# Altium schematic sheet SCH.SchDoc
size A1
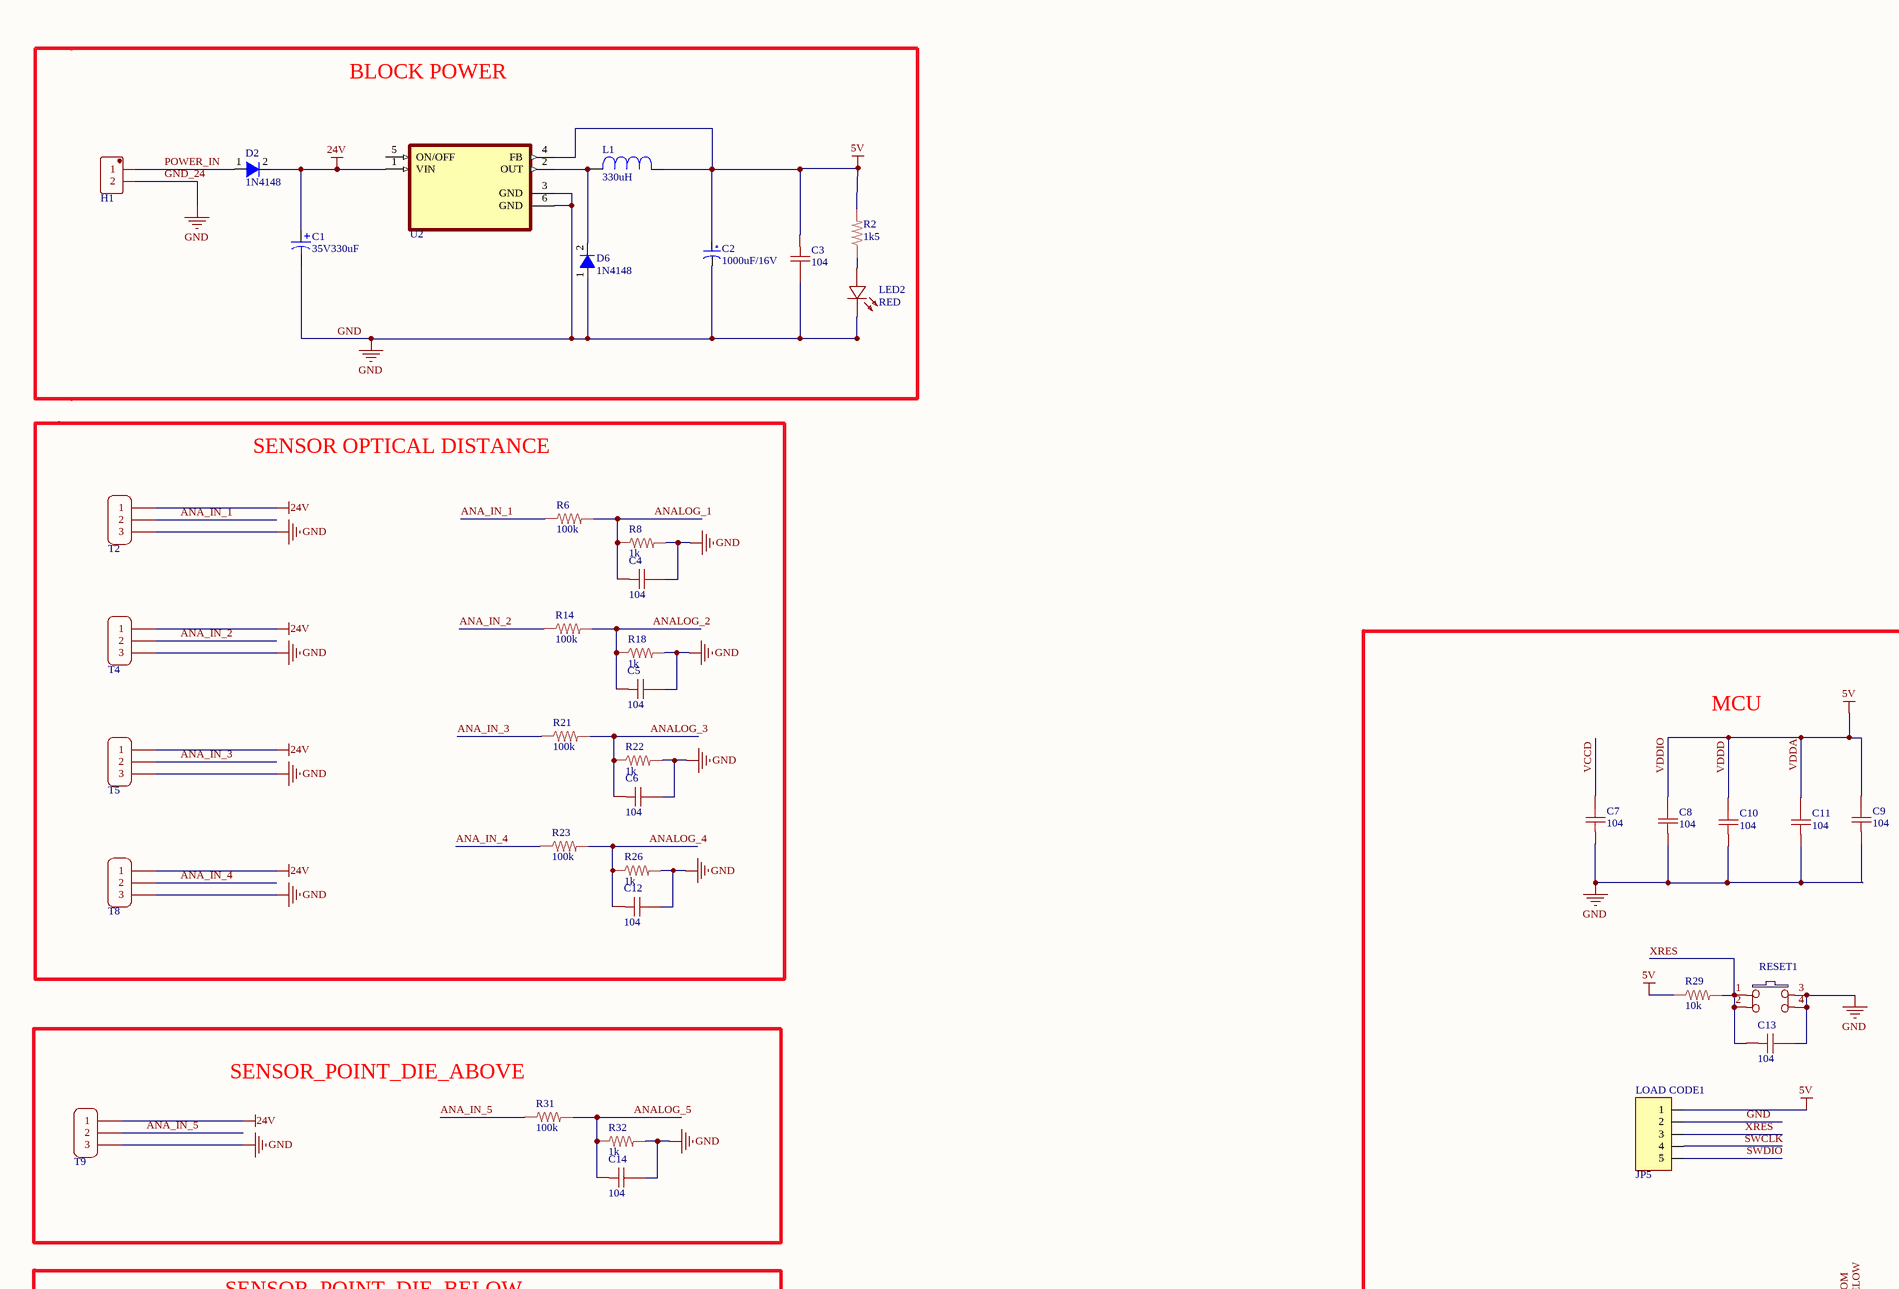
[diagram p0: SCH.SchDoc, top left]
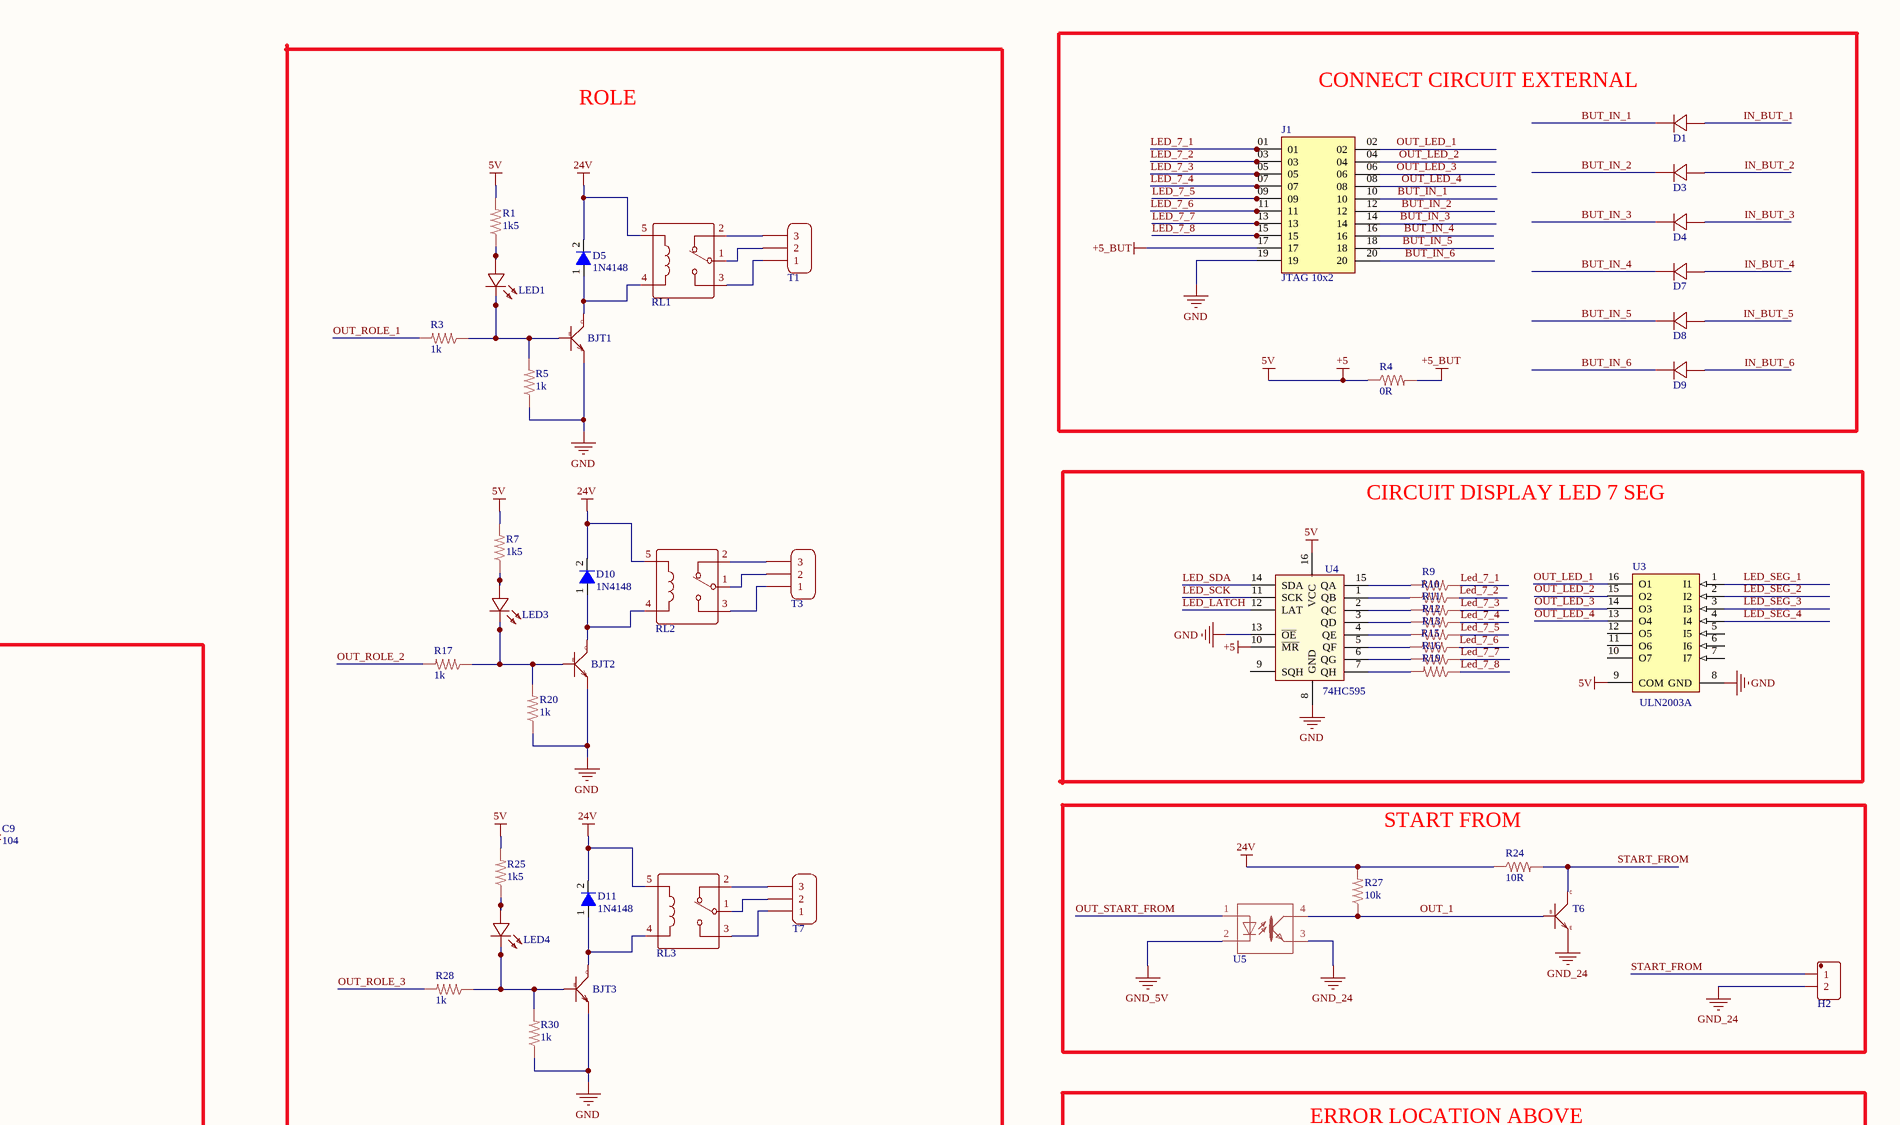
[diagram p1: SCH.SchDoc, top right]
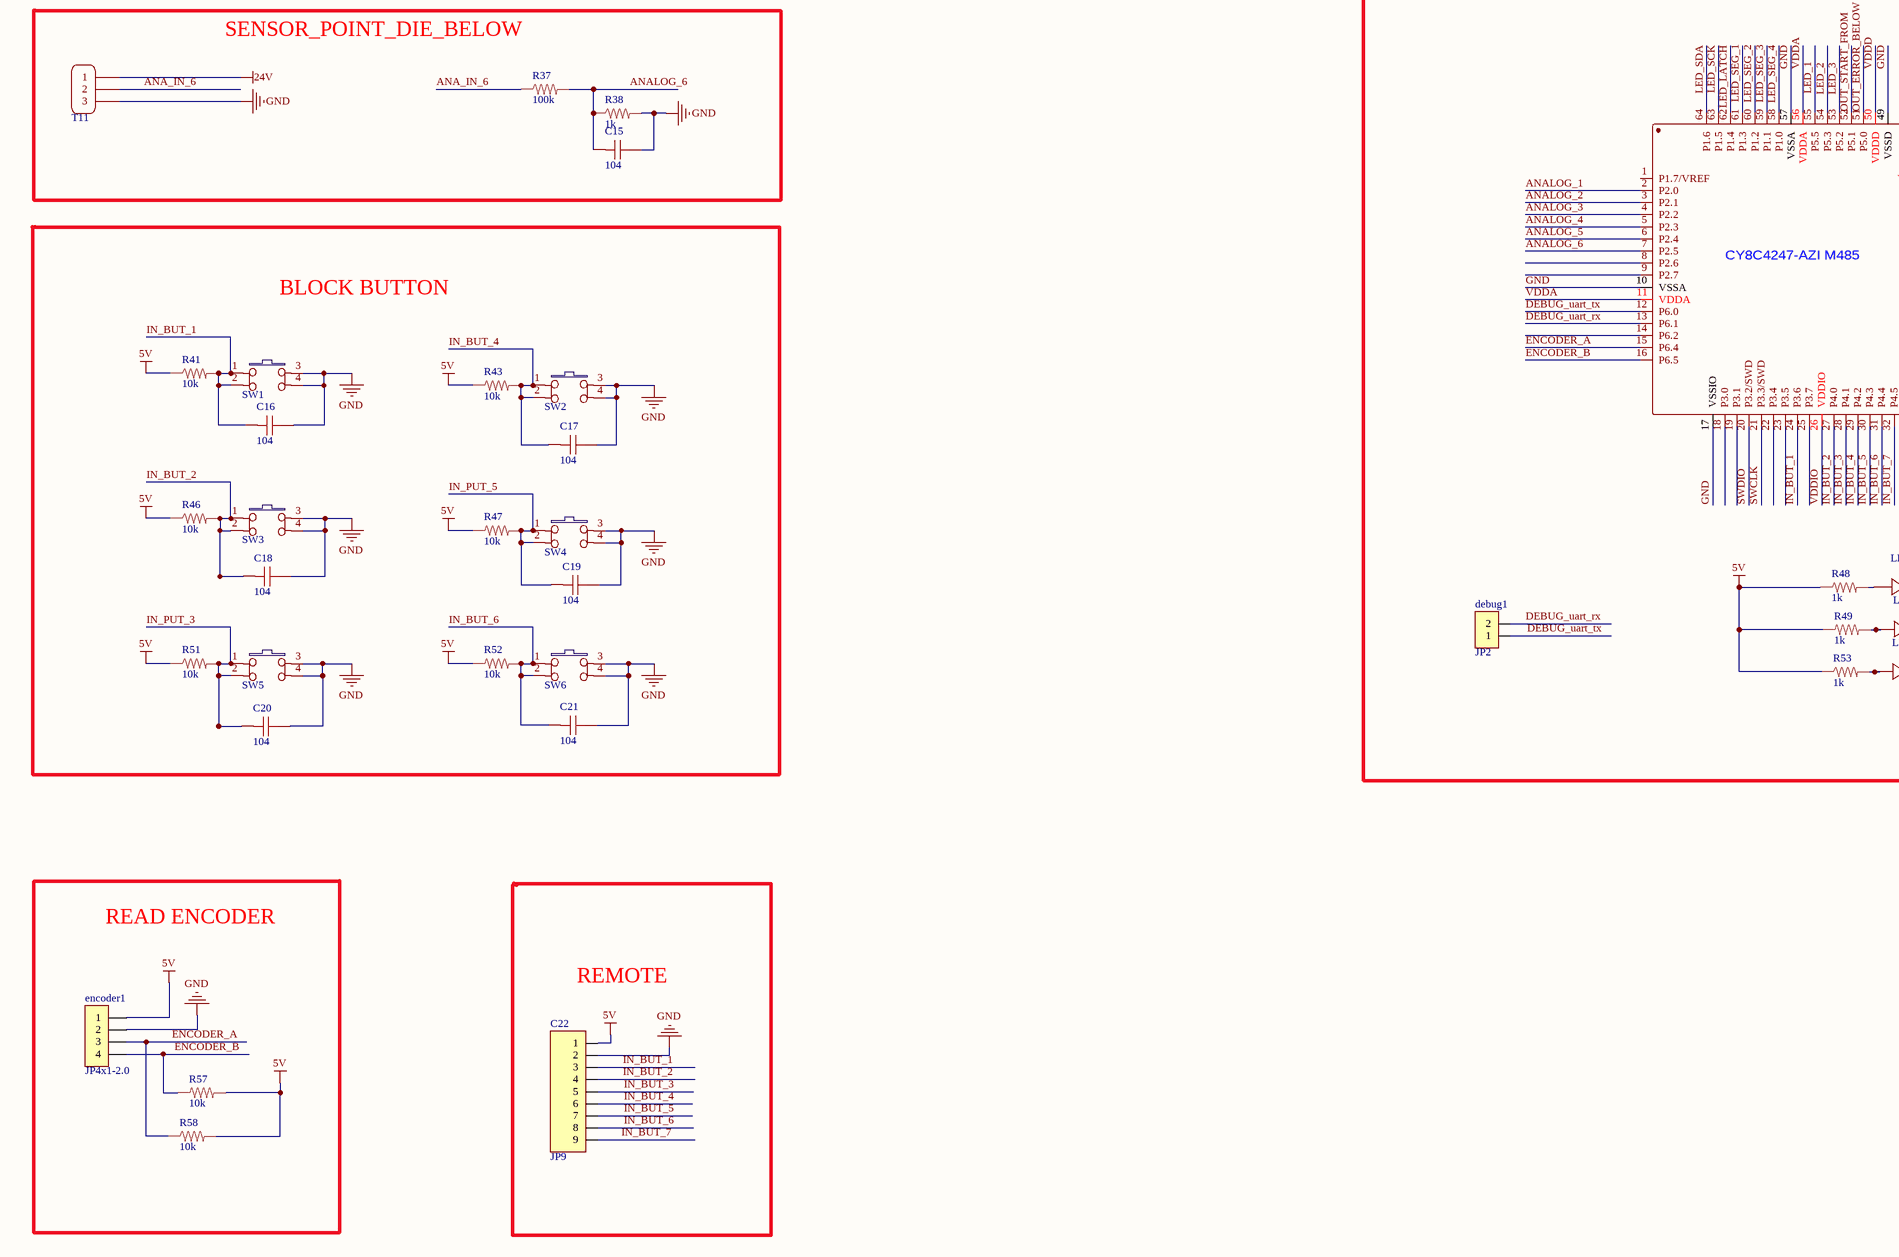
[diagram p2: SCH.SchDoc, bottom left]
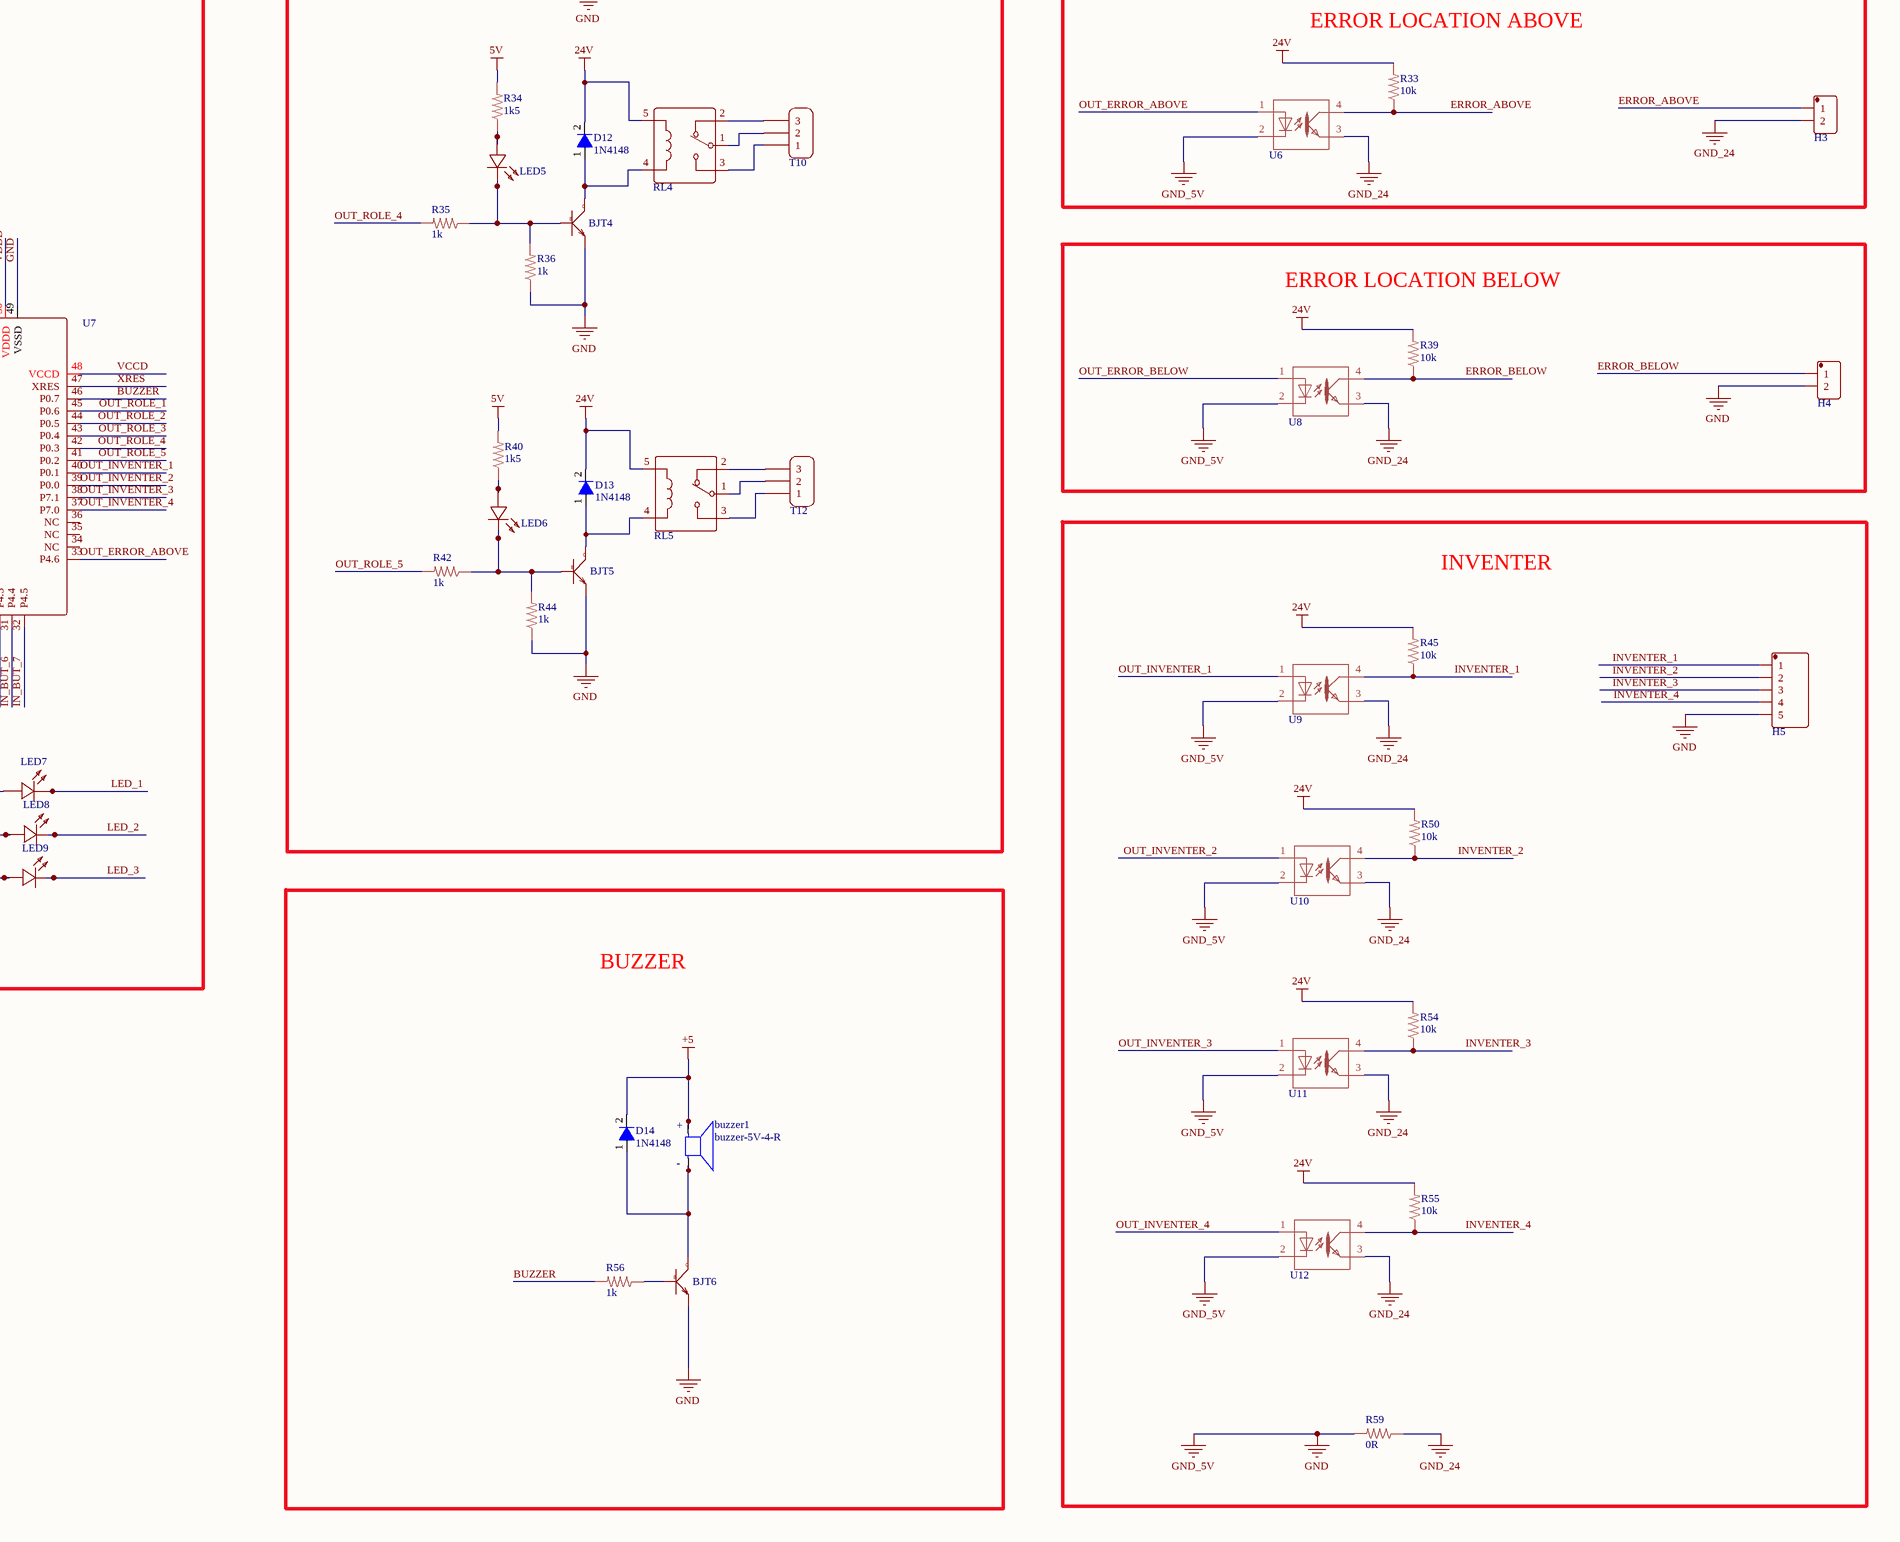
[diagram p3: SCH.SchDoc, bottom right]

## Parts
BJT1  NPN-SOT23  [SOT-23]  (value not drawn)
BJT2  NPN-SOT23  [SOT-23]  (value not drawn)
BJT3  NPN-SOT23  [SOT-23]  (value not drawn)
BJT4  NPN-SOT23  [SOT-23]  (value not drawn)
BJT5  NPN-SOT23  [SOT-23]  (value not drawn)
BJT6  NPN-SOT23  [SOT-23]  (value not drawn)
buzzer1  buzzer-5V-4-R  [buzzer 5V]
C1  35V330uF  [CAP POLY 220UF 16V]
C2  1000uF/16V  [CAP-ALU-SMD-F]
C3  value 104  [CAP_SMD_1206]  (hidden comment: Cap_SMD)
C4  value 104  [CAP_SMD_1206]  (hidden comment: Cap_SMD)
C5  value 104  [CAP_SMD_1206]  (hidden comment: Cap_SMD)
C6  value 104  [CAP_SMD_1206]  (hidden comment: Cap_SMD)
C7  value 104  [CAP_SMD_1206]  (hidden comment: Cap_SMD)
C8  value 104  [CAP_SMD_1206]  (hidden comment: Cap_SMD)
C9  value 104  [CAP_SMD_1206]  (hidden comment: Cap_SMD)
C10  value 104  [CAP_SMD_1206]  (hidden comment: Cap_SMD)
C11  value 104  [CAP_SMD_1206]  (hidden comment: Cap_SMD)
C12  value 104  [CAP_SMD_1206]  (hidden comment: Cap_SMD)
C13  value 104  [CAP_SMD_1206]  (hidden comment: Cap_SMD)
C14  value 104  [CAP_SMD_1206]  (hidden comment: Cap_SMD)
C15  value 104  [CAP_SMD_1206]  (hidden comment: Cap_SMD)
C16  value 104  [CAP_SMD_1206]  (hidden comment: Cap_SMD)
C17  value 104  [CAP_SMD_1206]  (hidden comment: Cap_SMD)
C18  value 104  [CAP_SMD_1206]  (hidden comment: Cap_SMD)
C19  value 104  [CAP_SMD_1206]  (hidden comment: Cap_SMD)
C20  value 104  [CAP_SMD_1206]  (hidden comment: Cap_SMD)
C21  value 104  [CAP_SMD_1206]  (hidden comment: Cap_SMD)
C22  JP9  [JP9-D1T]
D1  1N4007  [Diode M7]  (value not drawn)
D2  1N4148  [SOD-123]
D3  1N4007  [Diode M7]  (value not drawn)
D4  1N4007  [Diode M7]  (value not drawn)
D5  1N4148  [SOD-123]
D6  1N4148  [SOD-123]
D7  1N4007  [Diode M7]  (value not drawn)
D8  1N4007  [Diode M7]  (value not drawn)
D9  1N4007  [Diode M7]  (value not drawn)
D10  1N4148  [SOD-123]
D11  1N4148  [SOD-123]
D12  1N4148  [SOD-123]
D13  1N4148  [SOD-123]
D14  1N4148  [SOD-123]
debug1  JP2  [JP2-D1T]
encoder1  JP4x1-2.0  [J4-D1T]
H1  Terminal2x5.08  [EDG2P508]  (value not drawn)
H2  Terminal2x5.08  [EDG2P508]  (value not drawn)
H3  Terminal2x5.08  [EDG2P508]  (value not drawn)
H4  Terminal2x5.08  [EDG2P508]  (value not drawn)
H5  Terminal5x5.08  [EDG5P508]  (value not drawn)
J1  JTAG 10x2  [JTAG]
L1  value 330uH  [Inductor DR127]  (hidden comment: Inductor DR127)
LED1  LED_SMD  [LED_SMD_0805]  (value not drawn)
LED2  value RED  [LED_SMD_0805]  (hidden comment: LED_SMD)
LED3  LED_SMD  [LED_SMD_0805]  (value not drawn)
LED4  LED_SMD  [LED_SMD_0805]  (value not drawn)
LED5  LED_SMD  [LED_SMD_0805]  (value not drawn)
LED6  LED_SMD  [LED_SMD_0805]  (value not drawn)
LED7  LED_SMD  [LED_SMD_0805]  (value not drawn)
LED8  LED_SMD  [LED_SMD_0805]  (value not drawn)
LED9  LED_SMD  [LED_SMD_0805]  (value not drawn)
LOAD_CODE1  JP5  [JP5-D1T]
R1  value 1k5  [Res_SMD_0805]  (hidden comment: Res_SMD)
R2  value 1k5  [Res_SMD_0805]  (hidden comment: Res_SMD)
R3  value 1k  [Res_SMD_0805]  (hidden comment: Res_SMD)
R4  value 0R  [Res_SMD_1206]  (hidden comment: Res_SMD)
R5  value 1k  [Res_SMD_0805]  (hidden comment: Res_SMD)
R6  value 100k  [Res_SMD_1206]  (hidden comment: Res_SMD)
R7  value 1k5  [Res_SMD_0805]  (hidden comment: Res_SMD)
R8  value 1k  [Res_SMD_1206]  (hidden comment: Res_SMD)
R9  Res_SMD  [Res_SMD_0805]  (value not drawn)
R10  Res_SMD  [Res_SMD_0805]  (value not drawn)
R11  Res_SMD  [Res_SMD_0805]  (value not drawn)
R12  Res_SMD  [Res_SMD_0805]  (value not drawn)
R13  Res_SMD  [Res_SMD_0805]  (value not drawn)
R14  value 100k  [Res_SMD_1206]  (hidden comment: Res_SMD)
R15  Res_SMD  [Res_SMD_0805]  (value not drawn)
R16  Res_SMD  [Res_SMD_0805]  (value not drawn)
R17  value 1k  [Res_SMD_0805]  (hidden comment: Res_SMD)
R18  value 1k  [Res_SMD_1206]  (hidden comment: Res_SMD)
R19  Res_SMD  [Res_SMD_0805]  (value not drawn)
R20  value 1k  [Res_SMD_0805]  (hidden comment: Res_SMD)
R21  value 100k  [Res_SMD_1206]  (hidden comment: Res_SMD)
R22  value 1k  [Res_SMD_1206]  (hidden comment: Res_SMD)
R23  value 100k  [Res_SMD_1206]  (hidden comment: Res_SMD)
R24  value 10R  [RES_SMD_2512]  (hidden comment: Res_SMD)
R25  value 1k5  [Res_SMD_0805]  (hidden comment: Res_SMD)
R26  value 1k  [Res_SMD_1206]  (hidden comment: Res_SMD)
R27  value 10k  [Res_SMD_1206]  (hidden comment: Res_SMD)
R28  value 1k  [Res_SMD_0805]  (hidden comment: Res_SMD)
R29  value 10k  [Res_SMD_1206]  (hidden comment: Res_SMD)
R30  value 1k  [Res_SMD_0805]  (hidden comment: Res_SMD)
R31  value 100k  [Res_SMD_1206]  (hidden comment: Res_SMD)
R32  value 1k  [Res_SMD_1206]  (hidden comment: Res_SMD)
R33  value 10k  [Res_SMD_1206]  (hidden comment: Res_SMD)
R34  value 1k5  [Res_SMD_0805]  (hidden comment: Res_SMD)
R35  value 1k  [Res_SMD_0805]  (hidden comment: Res_SMD)
R36  value 1k  [Res_SMD_0805]  (hidden comment: Res_SMD)
R37  value 100k  [Res_SMD_1206]  (hidden comment: Res_SMD)
R38  value 1k  [Res_SMD_1206]  (hidden comment: Res_SMD)
R39  value 10k  [Res_SMD_1206]  (hidden comment: Res_SMD)
R40  value 1k5  [Res_SMD_0805]  (hidden comment: Res_SMD)
R41  value 10k  [Res_SMD_1206]  (hidden comment: Res_SMD)
R42  value 1k  [Res_SMD_0805]  (hidden comment: Res_SMD)
R43  value 10k  [Res_SMD_1206]  (hidden comment: Res_SMD)
R44  value 1k  [Res_SMD_0805]  (hidden comment: Res_SMD)
R45  value 10k  [Res_SMD_1206]  (hidden comment: Res_SMD)
R46  value 10k  [Res_SMD_1206]  (hidden comment: Res_SMD)
R47  value 10k  [Res_SMD_1206]  (hidden comment: Res_SMD)
R48  value 1k  [Res_SMD_1206]  (hidden comment: Res_SMD)
R49  value 1k  [Res_SMD_1206]  (hidden comment: Res_SMD)
R50  value 10k  [Res_SMD_1206]  (hidden comment: Res_SMD)
R51  value 10k  [Res_SMD_1206]  (hidden comment: Res_SMD)
R52  value 10k  [Res_SMD_1206]  (hidden comment: Res_SMD)
R53  value 1k  [Res_SMD_1206]  (hidden comment: Res_SMD)
R54  value 10k  [Res_SMD_1206]  (hidden comment: Res_SMD)
R55  value 10k  [Res_SMD_1206]  (hidden comment: Res_SMD)
R56  value 1k  [Res_SMD_0805]  (hidden comment: Res_SMD)
R57  value 10k  [Res_SMD_1206]  (hidden comment: Res_SMD)
R58  value 10k  [Res_SMD_1206]  (hidden comment: Res_SMD)
R59  value 0R  [Res_SMD_1206]  (hidden comment: Res_SMD)
RESET1  Button6x6  [Button6x6smd]  (value not drawn)
RL1  ReLay12V  [Relay 12V]  (value not drawn)
RL2  ReLay12V  [Relay 12V]  (value not drawn)
RL3  ReLay12V  [Relay 12V]  (value not drawn)
RL4  ReLay12V  [Relay 12V]  (value not drawn)
RL5  ReLay12V  [Relay 12V]  (value not drawn)
SW1  Button6x6  [Button6x6smd]  (value not drawn)
SW2  Button6x6  [Button6x6smd]  (value not drawn)
SW3  Button6x6  [Button6x6smd]  (value not drawn)
SW4  Button6x6  [Button6x6smd]  (value not drawn)
SW5  Button6x6  [Button6x6smd]  (value not drawn)
SW6  Button6x6  [Button6x6smd]  (value not drawn)
T1  Terminal B 3P  [Terminal-3p-381]  (value not drawn)
T2  Terminal B 3P  [Terminal-3p-381]  (value not drawn)
T3  Terminal B 3P  [Terminal-3p-381]  (value not drawn)
T4  Terminal B 3P  [Terminal-3p-381]  (value not drawn)
T5  Terminal B 3P  [Terminal-3p-381]  (value not drawn)
T6  TIP41C  [TO252]  (value not drawn)
T7  Terminal B 3P  [Terminal-3p-381]  (value not drawn)
T8  Terminal B 3P  [Terminal-3p-381]  (value not drawn)
T9  Terminal B 3P  [Terminal-3p-381]  (value not drawn)
T10  Terminal B 3P  [Terminal-3p-381]  (value not drawn)
T11  Terminal B 3P  [Terminal-3p-381]  (value not drawn)
T12  Terminal B 3P  [Terminal-3p-381]  (value not drawn)
U2  LM2576  [LM2576-5.0]  (value not drawn)
U3  ULN2003A  [SO-16]
U4  74HC595  [Sop16pin]
U5  PC817  [PC817]  (value not drawn)
U6  PC817  [PC817]  (value not drawn)
U7  CY8C4247  [TQFP64]  (value not drawn)
U8  PC817  [PC817]  (value not drawn)
U9  PC817  [PC817]  (value not drawn)
U10  PC817  [PC817]  (value not drawn)
U11  PC817  [PC817]  (value not drawn)
U12  PC817  [PC817]  (value not drawn)

## Blocks framed on the sheet
CONNECT CIRCUIT EXTERNAL: D1 D3 D4 D7-D9 J1 R4
BLOCK POWER: C1-C3 D2 D6 H1 L1 LED2 R2 U2
SENSOR OPTICAL DISTANCE: C4-C6 C12 R6 R8 R14 R18 R21-R23 R26 T2 T4 T5 T8
MCU: C7-C11 C13 debug1 LED7-LED9 LOAD_CODE1 R29 R48 R49 R53 RESET1 U7
START FROM: H2 R24 R27 T6 U5
SENSOR_POINT_DIE_ABOVE: C14 R31 R32 T9
ERROR LOCATION ABOVE: H3 R33 U6
SENSOR_POINT_DIE_BELOW: C15 R37 R38 T11
ERROR LOCATION BELOW: H4 R39 U8
BLOCK BUTTON: C16-C21 R41 R43 R46 R47 R51 R52 SW1-SW6
INVENTER: H5 R45 R50 R54 R55 R59 U9-U12
BUZZER: BJT6 buzzer1 D14 R56
READ ENCODER: encoder1 R57 R58

## Nets
24V: C1.1 D2.2(K) D5.2(K) D10.2(K) D11.2(K) D12.2(K) D13.2(K) R24.1 R27.2 R33.2 R39.2 R45.2 R50.2 R54.2 R55.2 RL1.5 RL2.5 RL3.5 RL4.5 RL5.5 T2.1 T4.1 T5.1 T8.1 T9.1 T11.1 U2.1(VIN)
+5_BUT: J1.17 R4.2
GND: BJT1.2 BJT2.2 BJT3.2 BJT4.2 BJT5.2 BJT6.2 C1.2 C2.2 C3.1 C4.1 C5.1 C6.1 C7.2 C8.2 C9.2 C10.2 C11.2 C12.1 C13.1 C14.1 C15.1 C16.1 C17.1 C18.1 C19.1 C20.1 C21.1 C22.2 D6.1(A) encoder1.2 H1.2 H2.2 H3.2 H4.2 H5.5 J1.19 LED2.2(K) LOAD_CODE1.2 R5.1 R8.2 R18.2 R20.1 R22.2 R26.2 R30.1 R32.2 R36.1 R38.2 R44.1 R59.1 R59.2 RESET1.3 RESET1.4 SW1.3 SW1.4 SW2.3 SW2.4 SW3.3 SW3.4 SW4.3 SW4.4 SW5.3 SW5.4 SW6.3 SW6.4 T2.3 T4.3 T5.3 T6.3(C) T8.3 T9.3 T11.3 U2.3(GND) U2.6(GND) U3.8(GND) U4.8(GND) U4.13(~{OE}) U5.2(C) U5.3(EMIT) U6.2(C) U6.3(EMIT) U7.10(VSSA) U7.17(VSSIO) U7.49(VSSD) U7.57(VSSA) U8.2(C) U8.3(EMIT) U9.2(C) U9.3(EMIT) U10.2(C) U10.3(EMIT) U11.2(C) U11.3(EMIT) U12.2(C) U12.3(EMIT)  [also labelled GND_24, GND_5V]
VDDA: buzzer1.P C2.1 C3.2 C8.1 C9.1 C10.1 C11.1 C22.1 D14.2(K) encoder1.1 L1.1 LOAD_CODE1.1 R1.2 R2.2 R4.1 R7.2 R25.2 R29.1 R34.2 R40.2 R41.1 R43.1 R46.1 R47.1 R48.1 R49.1 R51.1 R52.1 R53.1 R57.2 R58.2 U2.4(FB) U3.9(COM) U4.10(~{MR}) U4.16(VCC) U7.11(VDDA) U7.26(VDDIO) U7.50(VDDD) U7.56(VDDA)  [also labelled +5, 5V, VDDD, VDDIO]
ANA_IN_1: R6.1 T2.2
ANA_IN_2: R14.1 T4.2
ANA_IN_3: R21.1 T5.2
ANA_IN_4: R23.1 T8.2
ANA_IN_5: R31.1 T9.2
ANA_IN_6: R37.1 T11.2
ANALOG_1: C4.2 R6.2 R8.1 U7.2(P2.0)
ANALOG_2: C5.2 R14.2 R18.1 U7.3(P2.1)
ANALOG_3: C6.2 R21.2 R22.1 U7.4(P2.2)
ANALOG_4: C12.2 R23.2 R26.1 U7.5(P2.3)
ANALOG_5: C14.2 R31.2 R32.1 U7.6(P2.4)
ANALOG_6: C15.2 R37.2 R38.1 U7.7(P2.5)
BUT_IN_1: D1.2(K) J1.10
BUT_IN_2: D3.2(K) J1.12
BUT_IN_3: D4.2(K) J1.14
BUT_IN_4: D7.2(K) J1.16
BUT_IN_5: D8.2(K) J1.18
BUT_IN_6: D9.2(K) J1.20
BUZZER: R56.2 U7.46(P0.7)
DEBUG_uart_rx: debug1.2 U7.13(P6.1)
DEBUG_uart_tx: debug1.1 U7.12(P6.0)
ENCODER_A: encoder1.3 R58.1 U7.15(P6.4)
ENCODER_B: encoder1.4 R57.1 U7.16(P6.5)
ERROR_ABOVE: H3.1 R33.1 U6.4(COL)
ERROR_BELOW: H4.1 R39.1 U8.4(COL)
IN_BUT_1: C16.2 C22.3 D1.1(A) R41.2 SW1.1 SW1.2 U7.24(P3.6)
IN_BUT_2: C18.2 C22.4 D3.1(A) R46.2 SW3.1 SW3.2 U7.27(P4.0)
IN_BUT_3: C22.5 D4.1(A) U7.28(P4.1)
IN_BUT_4: C17.2 C22.6 D7.1(A) R43.2 SW2.1 SW2.2 U7.29(P4.2)
IN_BUT_5: C22.7 D8.1(A) U7.30(P4.3)
IN_BUT_6: C21.2 C22.8 D9.1(A) R52.2 SW6.1 SW6.2 U7.31(P4.4)
IN_BUT_7: C22.9 U7.32(P4.5)
IN_PUT_3: C20.2 R51.2 SW5.1 SW5.2
IN_PUT_5: C19.2 R47.2 SW4.1 SW4.2
INVENTER_1: H5.1 R45.1 U9.4(COL)
INVENTER_2: H5.2 R50.1 U10.4(COL)
INVENTER_3: H5.3 R54.1 U11.4(COL)
INVENTER_4: H5.4 R55.1 U12.4(COL)
LED_1: LED7.2(K) U7.55(P5.5)
LED_2: LED8.2(K) U7.54(P5.3)
LED_3: LED9.2(K) U7.53(P5.2)
LED_7_1: J1.01 R9.1
LED_7_2: J1.03 R10.1
LED_7_3: J1.05 R11.1
LED_7_4: J1.07 R12.1
LED_7_5: J1.09 R13.1
LED_7_6: J1.11 R15.1
LED_7_7: J1.13 R16.1
LED_7_8: J1.15 R19.1
LED_LATCH: U4.12(LAT) U7.62(P1.4)
LED_SCK: U4.11(SCK) U7.63(P1.5)
LED_SDA: U4.14(SDA) U7.64(P1.6)
LED_SEG_1: U3.1(I1) U7.61(P1.3)
LED_SEG_2: U3.2(I2) U7.60(P1.2)
LED_SEG_3: U3.3(I3) U7.59(P1.1)
LED_SEG_4: U3.4(I4) U7.58(P1.0)
OUT_1: R27.1 T6.1(B) U5.4(COL)
OUT_ERROR_ABOVE: U6.1(A) U7.33(P4.6)
OUT_ERROR_BELOW: U7.51(P5.0) U8.1(A)
OUT_INVENTER_1: U7.40(P0.1) U9.1(A)
OUT_INVENTER_2: U7.39(P0.0) U10.1(A)
OUT_INVENTER_3: U7.38(P7.1) U11.1(A)
OUT_INVENTER_4: U7.37(P7.0) U12.1(A)
OUT_LED_1: J1.02 U3.16(O1)
OUT_LED_2: J1.04 U3.15(O2)
OUT_LED_3: J1.06 U3.14(O3)
OUT_LED_4: J1.08 U3.13(O4)
OUT_ROLE_1: R3.2 U7.45(P0.6)
OUT_ROLE_2: R17.2 U7.44(P0.5)
OUT_ROLE_3: R28.2 U7.43(P0.4)
OUT_ROLE_4: R35.2 U7.42(P0.3)
OUT_ROLE_5: R42.2 U7.41(P0.2)
OUT_START_FROM: U5.1(A) U7.52(P5.1)
POWER_IN: D2.1(A) H1.1
START_FROM: H2.1 R24.2 T6.2(E)
SWCLK: LOAD_CODE1.4 U7.21(P3.3/SWD)
SWDIO: LOAD_CODE1.5 U7.20(P3.2/SWD)
VCCD: C7.1 U7.48(VCCD)
XRES: C13.2 LOAD_CODE1.3 R29.2 RESET1.1 RESET1.2 U7.47(XRES)
NetBJT1_1: BJT1.1 LED1.2(K) R3.1 R5.2
NetBJT1_3: BJT1.3 D5.1(A) RL1.4
NetBJT2_1: BJT2.1 LED3.2(K) R17.1 R20.2
NetBJT2_3: BJT2.3 D10.1(A) RL2.4
NetBJT3_1: BJT3.1 LED4.2(K) R28.1 R30.2
NetBJT3_3: BJT3.3 D11.1(A) RL3.4
NetBJT4_1: BJT4.1 LED5.2(K) R35.1 R36.2
NetBJT4_3: BJT4.3 D12.1(A) RL4.4
NetBJT5_1: BJT5.1 LED6.2(K) R42.1 R44.2
NetBJT5_3: BJT5.3 D13.1(A) RL5.4
NetBJT6_1: BJT6.1 R56.1
NetBJT6_3: BJT6.3 buzzer1.N D14.1(A)
NetD6_2: D6.2(K) L1.2 U2.2(OUT)
NetLED1_1: LED1.1(A) R1.1
NetLED2_1: LED2.1(A) R2.1
NetLED3_1: LED3.1(A) R7.1
NetLED4_1: LED4.1(A) R25.1
NetLED5_1: LED5.1(A) R34.1
NetLED6_1: LED6.1(A) R40.1
NetLED7_1: LED7.1(A) R48.2
NetLED8_1: LED8.1(A) R49.2
NetLED9_1: LED9.1(A) R53.2
NetR9_2: R9.2 U4.15(QA)
NetR10_2: R10.2 U4.1(QB)
NetR11_2: R11.2 U4.2(QC)
NetR12_2: R12.2 U4.3(QD)
NetR13_2: R13.2 U4.4(QE)
NetR15_2: R15.2 U4.5(QF)
NetR16_2: R16.2 U4.6(QG)
NetR19_2: R19.2 U4.7(QH)
NetRL1_1: RL1.1 T1.2
NetRL1_2: RL1.2 T1.3
NetRL1_3: RL1.3 T1.1
NetRL2_1: RL2.1 T3.2
NetRL2_2: RL2.2 T3.3
NetRL2_3: RL2.3 T3.1
NetRL3_1: RL3.1 T7.2
NetRL3_2: RL3.2 T7.3
NetRL3_3: RL3.3 T7.1
NetRL4_1: RL4.1 T10.2
NetRL4_2: RL4.2 T10.3
NetRL4_3: RL4.3 T10.1
NetRL5_1: RL5.1 T12.2
NetRL5_2: RL5.2 T12.3
NetRL5_3: RL5.3 T12.1

Not connected (* = marked no-connect by the designer): U2 5(ON/OFF); U3 5(I5) 6(I6) 7(I7) 10(O7) 11(O6) 12(O5); U4 9(SQH); U7 1(P1.7/VREF) 8(P2.6) 9(P2.7) 14(P6.2) 18(P3.0) 19(P3.1) 22(P3.4) 23(P3.5) 25(P3.7) 34(NC) 35(NC) 36(NC)

## Notes on the sheet
- ROLE
- CIRCUIT DISPLAY LED 7 SEG
- REMOTE
- Title
- Size:
- Date:
- File:
- A1
- Number:
- Time:
- Revision:
- Sheet
- of
- (in symbol buzzer-5V-4-R) +; -
- (in symbol CY8C4247) CY8C4247-AZI M485
- (in symbol NPN-SOT23) C; B; E

## Library data of the parts
BJT1-BJT6 = NPN-SOT23: TRansistor NPN sot23
buzzer1 = buzzer-5V-4-R: buzzer-5V-4-R-2300 HZ; MF: PUI Audio; MP: AI-1223-TWT-5V-4-R; Digi-Key_Part_Number: 668-1457-ND; SnapEDA_Link: https://www.snapeda.com/parts/AI-1223-TWT-5V-4-R/PUI+Audio/view-part/?ref=snap; Purchase-URL: https://pricing.snapeda.com/search/part/AI-1223-TWT-5V-4-R/?ref=eda; Package: None; Check_prices: https://www.snapeda.com/parts/AI-1223-TWT-5V-4-R/PUI+Audio/view-part/?ref=eda; Value: *
C1 = Cap Pol1: Polarized Capacitor (Radial); Published: 8-Jun-2000; LatestRevisionDate: 17-Jul-2002; LatestRevisionNote: Re-released for DXP Platform.; PackageReference: RB7.6-15; Publisher: Altium Limited; PackageDescription: Polarized Capacitor (Radial); 2 Leads
C2 = CP4: Cap 1000uF/16V - 220uF/50V; Description 5: 4,7uF>10uF/250V_3,3uF>10uF/400V - 2,2uF>4,7uF/450V; Description 1: 2200uF-3300uF/6,3V - 1000uF-2200uF/10V; Description 2: 1000uF/16V - 470uF => 1000uF/25V - 100uF/100V; Description 3: 330uF>470uF/35V_220uF>470uF/50V_10uF>22uF/250V; Description 4: 220uF => 330uF/63V - 10uF =>33uF/160 - 200V; Value: 1000uF/16V
C3-C21 = Cap_SMD: Cap SMD multiple types as 0402 0603 0805 1206
C22 = JP9: WR-PHD 2.54 mm Angled Socket Header; Manufacturer: W¨¹rth Elektronik eiSos GmbH; partNo: 613009143121; ComponentLink1 Description: Manufacturer; ComponentLink2 Description: Datasheet; NoPins: 09; Created Date: 29 March 2013; ComponentLink1URL: http://www.we-online.com; ComponentLink2URL: http://katalog.we-online.de/em/datasheet/6130xx143121.pdf; Created by: Karrer Zheng
D1 D3 D4 D7-D9 = 1N4007: diode SMD M7
D2 D5 D6 D10-D14 = 1N4148: Diode Fast Switching; Value: 1N4148
debug1 = JP2: WR-PHD 2.54 mm Angled Socket Header; Manufacturer: W¨¹rth Elektronik eiSos GmbH; partNo: 613002143121; ComponentLink1 Description: Manufacturer; ComponentLink2 Description: Datasheet; NoPins: 02; Created Date: 29 March 2013; ComponentLink1URL: http://www.we-online.com; ComponentLink2URL: http://katalog.we-online.de/em/datasheet/6130xx143121.pdf; Created by: Karrer Zheng
encoder1 = JP4x1-2.0: WR-PHD 2.00 mm Socket Header; Manufacturer: W¨¹rth Elektronik eiSos GmbH; partNo: 62000411821; ComponentLink1 Description: Manufacturer; ComponentLink2 Description: Datasheet; NoPins: 04; Created Date: 2 April 2013; ComponentLink1URL: http://www.we-online.com; ComponentLink2URL: http://katalog.we-online.de/em/datasheet/6200xx11821.pdf; Created by: Karrer Zheng
H1-H4 = Terminal2x5.08: terminal 5.08mm x2 pins
H5 = Terminal5x5.08: terminal edg 5.08mm 5 pins
J1 = JTAG 10x2: Connector Header Through Hole 20 position 0.100 (2.54mm); MP: TSS-110-01-G-D; MF: Samtec; Package: None; SnapEDA_Link: https://www.snapeda.com/parts/TSS-110-01-G-D/Samtec%20Inc./view-part/930553/?ref=snap; Value: *; Availability: Bad; Toby_UK-Purchase-URL: https://snapeda.com/shop?store=Toby+UK&id=930553; Price: None
L1 = Inductor DR127: Inductor SMD DR127 - 12.5mm
LED1 LED3-LED9 = LED_SMD: LED SMD 0603 0805 1206; Value: RED
LED2 = LED_SMD: LED SMD 0603 0805 1206
LOAD_CODE1 = JP5: WR-PHD 2.54 mm Angled Socket Header; Manufacturer: W¨¹rth Elektronik eiSos GmbH; partNo: 613005143121; ComponentLink1 Description: Manufacturer; ComponentLink2 Description: Datasheet; NoPins: 05; Created Date: 29 March 2013; ComponentLink1URL: http://www.we-online.com; ComponentLink2URL: http://katalog.we-online.de/em/datasheet/6130xx143121.pdf; Created by: Karrer Zheng
R1-R8 R14 R17 R18 R20-R59 = Res_SMD: res smd
R9-R13 R15 R16 R19 = Res_SMD: res smd; Value: 180
RESET1 SW1-SW6 = Button6x6: button 6x6 mm
RL1-RL5 = ReLay12V: Relay 12V 5Pins
T1-T5 T7-T12 = Terminal B 3P: Terminal Block 3 pins
T6 = TIP41C: Transistor NPN
U2 = LM2576: IC Buck 5Volt
U3 = ULN2003A: High-Voltage, High-Current Darlington Array; LatestRevisionNote: Stylized 3D Model Added.; Publisher: Altium Limited; Value: ULN2003A
U4 = 74595: 8 Bit Serial input - Parallel Output; Value: 74HC595
U5 U6 U8-U12 = PC817: IC opto
U7 = CY8C4247: Psoc Cy8c4247 64 pins